# Altium schematic sheet Accumulator.SchDoc
size 127 x 162 mm; Origin: Eagle
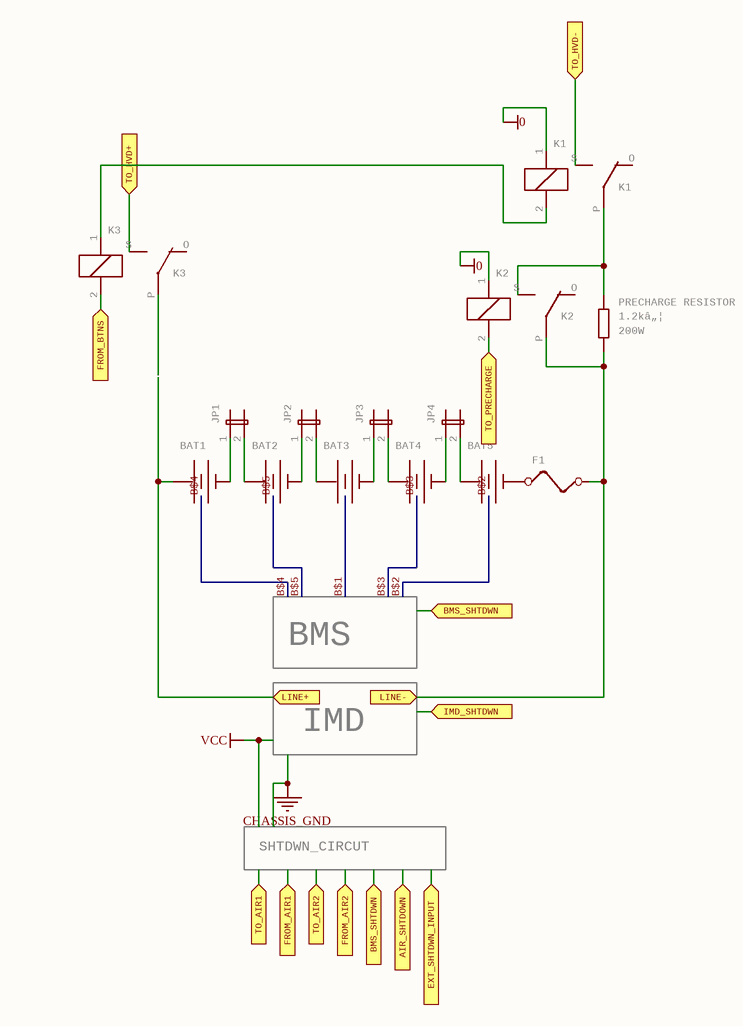
[diagram p0: Accumulator.SchDoc]

## Parts
BAT1  BATTERY  [BATTERY]  (value not drawn)
BAT2  BATTERY  [BATTERY]  (value not drawn)
BAT3  BATTERY  [BATTERY]  (value not drawn)
BAT4  BATTERY  [BATTERY]  (value not drawn)
BAT5  BATTERY  [BATTERY]  (value not drawn)
F1  FUSE  [FUSE]  (value not drawn)
JP1  JP1E  [JP1]  (value not drawn)
JP2  JP1E  [JP1]  (value not drawn)
JP3  JP1E  [JP1]  (value not drawn)
JP4  JP1E  [JP1]  (value not drawn)
K1  PART: K1  [E3206S]  (hidden comment: E3206S)  (parts A,B of 2)
K2  PART: K2  [E3206S]  (hidden comment: E3206S)  (parts A,B of 2)
K3  PART: K3  [E3206S]  (hidden comment: E3206S)  (parts A,B of 2)
R1  R  (value not drawn)

## Ports
AIR_SHTDOWN (in), BMS_SHTDWN (in), EXT_SHTDWN_INPUT (in), FROM_AIR1 (in), FROM_AIR2 (in), FROM_BTNS (in), IMD_SHTDWN (in), LINE+ (in), LINE- (in), TO_AIR1 (in), TO_AIR2 (in), TO_HVD+ (in), TO_HVD- (in), TO_PRECHARGE (in)

## Nets
0: K1.1 K2.1
FROM_BTNS: K3.2 ; port FROM_BTNS
LINE+: BAT1.+ ; port LINE+
LINE-: F1.2 K2.P ; port LINE-
TO_HVD+: K3.S ; port TO_HVD+
TO_HVD-: K1.S ; port TO_HVD-
TO_PRECHARGE: K2.2 ; port TO_PRECHARGE
NetBAT1_-: BAT1.- JP1.1
NetBAT2_+: BAT2.+ JP1.2
NetBAT2_-: BAT2.- JP2.1
NetBAT3_+: BAT3.+ JP2.2
NetBAT3_-: BAT3.- JP3.1
NetBAT4_+: BAT4.+ JP3.2
NetBAT4_-: BAT4.- JP4.1
NetBAT5_+: BAT5.+ JP4.2
NetBAT5_-: BAT5.- F1.1
NetK1_2: K1.2 K3.1
NetK1_P: K1.P K2.S

Not connected (* = marked no-connect by the designer): BAT1 +@1(+); BAT2 +@1(+); BAT3 +@1(+); BAT4 +@1(+); BAT5 +@1(+); K1 O; K2 O; K3 O P

## Buses and harness runs
bus B$1
bus B$2
bus B$3
bus B$4
bus B$5

## Notes on the sheet
- (near R1) PRECHARGE RESISTOR
- (near R1) 1.2kâ„¦
- (near R1) 200W
- BMS
- IMD
- SHTDWN_CIRCUT

## Library data of the parts
BAT1-BAT5 = BATTERY: GateName_1: G$1; SymbolName_1: BATTERY; LibraryName: special; DeviceSetName: BATTERY
F1 = FUSE: FUSE   5 x 20 mm; GateName_1: G$1; SymbolName_1: FUSE; LibraryName: special; DeviceSetName: FUSE
JP1-JP4 = JP1E: JUMPER; GateName_1: A; SymbolName_1: JP2E; LibraryName: jumper; DeviceSetName: JP1E
K1-K3 = E3206S: RELAY   1 x switch, Eichhoff/distributor Schukat; GateName_1: 1; SymbolName_1: K; GateName_2: 2; SymbolName_2: U; LibraryName: relay; DeviceSetName: E3206S; MF: MF; MPN: MPN; OC_FARNELL: unknown; OC_NEWARK: unknown
R1 = R: RESISTOR; GateName_1: G$1; SymbolName_1: RESISTOR; LibraryName: docu-dummy; DeviceSetName: R